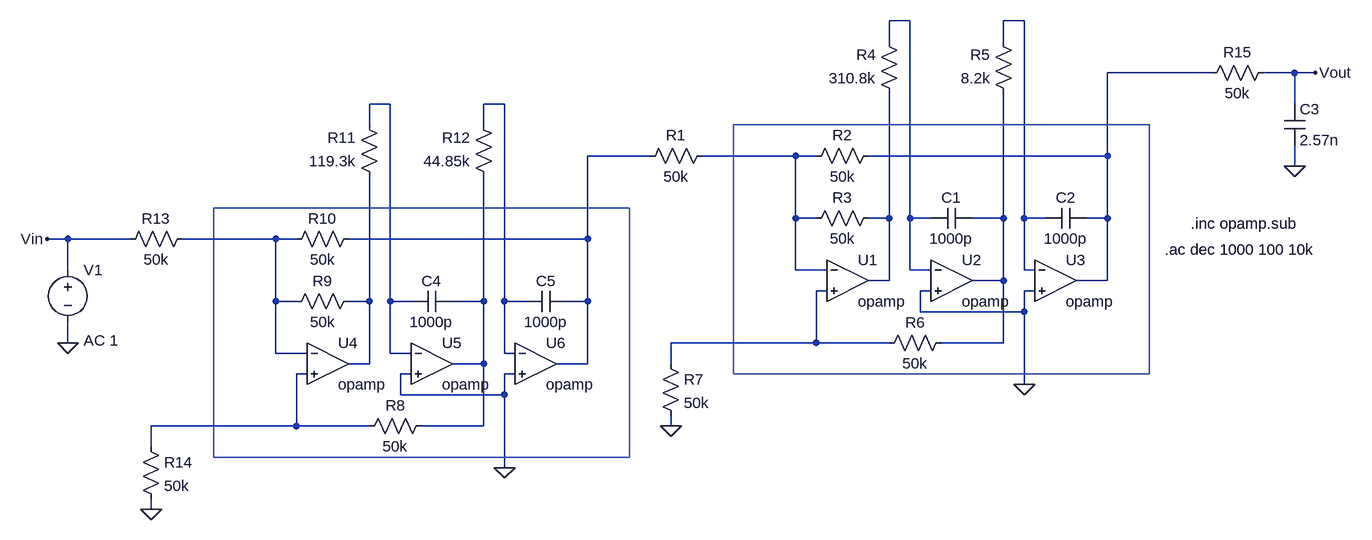
[diagram p0: schematic tp2-ej3.asc]
tp2-ej3.asc, the LTspice schematic file:
Version 4
SHEET 1 952 680
WIRE 256 -224 224 -224
WIRE 432 -224 400 -224
WIRE 224 -192 224 -224
WIRE 400 -192 400 -224
WIRE 720 -144 560 -144
WIRE 848 -144 800 -144
WIRE 880 -144 848 -144
WIRE -544 -96 -576 -96
WIRE -368 -96 -400 -96
WIRE 848 -96 848 -144
WIRE -576 -64 -576 -96
WIRE -400 -64 -400 -96
WIRE -144 -16 -240 -16
WIRE 80 -16 -64 -16
WIRE 112 -16 80 -16
WIRE 560 -16 560 -144
WIRE 560 -16 192 -16
WIRE 848 0 848 -32
WIRE 80 80 80 -16
WIRE 112 80 80 80
WIRE 224 80 224 -112
WIRE 224 80 192 80
WIRE 256 80 256 -224
WIRE 288 80 256 80
WIRE 400 80 400 -112
WIRE 400 80 352 80
WIRE 432 80 432 -224
WIRE 464 80 432 80
WIRE 560 80 560 -16
WIRE 560 80 528 80
WIRE -1040 112 -1072 112
WIRE -944 112 -1040 112
WIRE -720 112 -864 112
WIRE -688 112 -720 112
WIRE -240 112 -240 -16
WIRE -240 112 -608 112
WIRE -1040 160 -1040 112
WIRE 80 160 80 80
WIRE 128 160 80 160
WIRE 256 160 256 80
WIRE 288 160 256 160
WIRE 432 160 432 80
WIRE 448 160 432 160
WIRE 224 176 224 80
WIRE 224 176 192 176
WIRE 400 176 400 80
WIRE 400 176 352 176
WIRE 560 176 560 80
WIRE 560 176 512 176
WIRE 128 192 112 192
WIRE 288 192 272 192
WIRE 448 192 432 192
WIRE -720 208 -720 112
WIRE -688 208 -720 208
WIRE -576 208 -576 16
WIRE -576 208 -608 208
WIRE -544 208 -544 -96
WIRE -512 208 -544 208
WIRE -400 208 -400 16
WIRE -400 208 -448 208
WIRE -368 208 -368 -96
WIRE -336 208 -368 208
WIRE -240 208 -240 112
WIRE -240 208 -272 208
WIRE 272 224 272 192
WIRE 432 224 432 192
WIRE 432 224 272 224
WIRE -1040 272 -1040 240
WIRE 112 272 112 192
WIRE 112 272 -112 272
WIRE 224 272 112 272
WIRE 400 272 400 176
WIRE 400 272 304 272
WIRE -720 288 -720 208
WIRE -672 288 -720 288
WIRE -544 288 -544 208
WIRE -512 288 -544 288
WIRE -368 288 -368 208
WIRE -352 288 -368 288
WIRE -576 304 -576 208
WIRE -576 304 -608 304
WIRE -400 304 -400 208
WIRE -400 304 -448 304
WIRE -240 304 -240 208
WIRE -240 304 -288 304
WIRE -112 304 -112 272
WIRE -672 320 -688 320
WIRE -512 320 -528 320
WIRE -352 320 -368 320
WIRE 432 336 432 224
WIRE -528 352 -528 320
WIRE -368 352 -368 320
WIRE -368 352 -528 352
WIRE -688 400 -688 320
WIRE -688 400 -912 400
WIRE -576 400 -688 400
WIRE -400 400 -400 304
WIRE -400 400 -496 400
WIRE -112 400 -112 384
WIRE -912 432 -912 400
WIRE -368 464 -368 352
WIRE -912 528 -912 512
FLAG 432 336 0
FLAG -1040 272 0
FLAG 848 0 0
FLAG 880 -144 Vout
FLAG -1072 112 Vin
FLAG -112 400 0
FLAG -368 464 0
FLAG -912 528 0
SYMBOL Opamps\\opamp 160 112 R0
SYMATTR InstName U1
SYMBOL Opamps\\opamp 320 112 R0
SYMATTR InstName U2
SYMBOL Opamps\\opamp 480 112 R0
SYMATTR InstName U3
SYMBOL res 320 256 R90
WINDOW 0 0 56 VBottom 2
WINDOW 3 32 56 VTop 2
SYMATTR InstName R6
SYMATTR Value 50k
SYMBOL res 208 64 R90
WINDOW 0 0 56 VBottom 2
WINDOW 3 32 56 VTop 2
SYMATTR InstName R3
SYMATTR Value 50k
SYMBOL res 208 -32 R90
WINDOW 0 0 56 VBottom 2
WINDOW 3 32 56 VTop 2
SYMATTR InstName R2
SYMATTR Value 50k
SYMBOL cap 352 64 R90
WINDOW 0 0 32 VBottom 2
WINDOW 3 32 32 VTop 2
SYMATTR InstName C1
SYMATTR Value 1000p
SYMBOL cap 528 64 R90
WINDOW 0 0 32 VBottom 2
WINDOW 3 32 32 VTop 2
SYMATTR InstName C2
SYMATTR Value 1000p
SYMBOL res 240 -96 R180
WINDOW 0 36 76 Left 2
WINDOW 3 36 40 Left 2
SYMATTR InstName R4
SYMATTR Value 310.8k
SYMBOL res 416 -96 R180
WINDOW 0 36 76 Left 2
WINDOW 3 36 40 Left 2
SYMATTR InstName R5
SYMATTR Value 8.2k
SYMBOL voltage -1040 144 R0
WINDOW 123 24 124 Left 2
WINDOW 39 0 0 Left 0
SYMATTR Value2 AC 1
SYMATTR InstName V1
SYMATTR Value ""
SYMBOL res 816 -160 R90
WINDOW 0 0 56 VBottom 2
WINDOW 3 32 56 VTop 2
SYMATTR InstName R15
SYMATTR Value 50k
SYMBOL cap 832 -96 R0
SYMATTR InstName C3
SYMATTR Value 2.57n
SYMBOL res -48 -32 R90
WINDOW 0 0 56 VBottom 2
WINDOW 3 32 56 VTop 2
SYMATTR InstName R1
SYMATTR Value 50k
SYMBOL res -128 288 R0
SYMATTR InstName R7
SYMATTR Value 50k
SYMBOL Opamps\\opamp -640 240 R0
SYMATTR InstName U4
SYMBOL Opamps\\opamp -480 240 R0
SYMATTR InstName U5
SYMBOL Opamps\\opamp -320 240 R0
SYMATTR InstName U6
SYMBOL res -480 384 R90
WINDOW 0 0 56 VBottom 2
WINDOW 3 32 56 VTop 2
SYMATTR InstName R8
SYMATTR Value 50k
SYMBOL res -592 192 R90
WINDOW 0 0 56 VBottom 2
WINDOW 3 32 56 VTop 2
SYMATTR InstName R9
SYMATTR Value 50k
SYMBOL res -592 96 R90
WINDOW 0 0 56 VBottom 2
WINDOW 3 32 56 VTop 2
SYMATTR InstName R10
SYMATTR Value 50k
SYMBOL cap -448 192 R90
WINDOW 0 0 32 VBottom 2
WINDOW 3 32 32 VTop 2
SYMATTR InstName C4
SYMATTR Value 1000p
SYMBOL cap -272 192 R90
WINDOW 0 0 32 VBottom 2
WINDOW 3 32 32 VTop 2
SYMATTR InstName C5
SYMATTR Value 1000p
SYMBOL res -560 32 R180
WINDOW 0 36 76 Left 2
WINDOW 3 36 40 Left 2
SYMATTR InstName R11
SYMATTR Value 119.3k
SYMBOL res -384 32 R180
WINDOW 0 36 76 Left 2
WINDOW 3 36 40 Left 2
SYMATTR InstName R12
SYMATTR Value 44.85k
SYMBOL res -848 96 R90
WINDOW 0 0 56 VBottom 2
WINDOW 3 32 56 VTop 2
SYMATTR InstName R13
SYMATTR Value 50k
SYMBOL res -928 416 R0
SYMATTR InstName R14
SYMATTR Value 50k
TEXT 688 88 Left 2 !.inc opamp.sub
TEXT 648 128 Left 2 !.ac dec 1000 100 10k
RECTANGLE Normal 624 320 -16 -64
RECTANGLE Normal -176 448 -816 64

The netlist it stands for:
* tp2-ej3.asc
XU1 N007 N011 N008 opamp Aol=100K GBW=10Meg  ; pins invin noninvin out
XU2 N001 0 N009 opamp Aol=100K GBW=10Meg  ; pins invin noninvin out
XU3 N002 0 N003 opamp Aol=100K GBW=10Meg  ; pins invin noninvin out
R6 N009 N011 50k
R3 N008 N007 50k
R2 N003 N007 50k
C1 N009 N001 1000p
C2 N003 N002 1000p
R4 N008 N001 310.8k
R5 N009 N002 8.2k
V1 Vin 0 AC 1
R15 Vout N003 50k
C3 Vout 0 2.57n
R1 N007 N006 50k
R7 N011 0 50k
XU4 N010 N014 N012 opamp Aol=100K GBW=10Meg  ; pins invin noninvin out
XU5 N004 0 N013 opamp Aol=100K GBW=10Meg  ; pins invin noninvin out
XU6 N005 0 N006 opamp Aol=100K GBW=10Meg  ; pins invin noninvin out
R8 N013 N014 50k
R9 N012 N010 50k
R10 N006 N010 50k
C4 N013 N004 1000p
C5 N006 N005 1000p
R11 N012 N004 119.3k
R12 N013 N005 44.85k
R13 N010 Vin 50k
R14 N014 0 50k
.inc opamp.sub
.ac dec 1000 100 10k
.backanno
.end